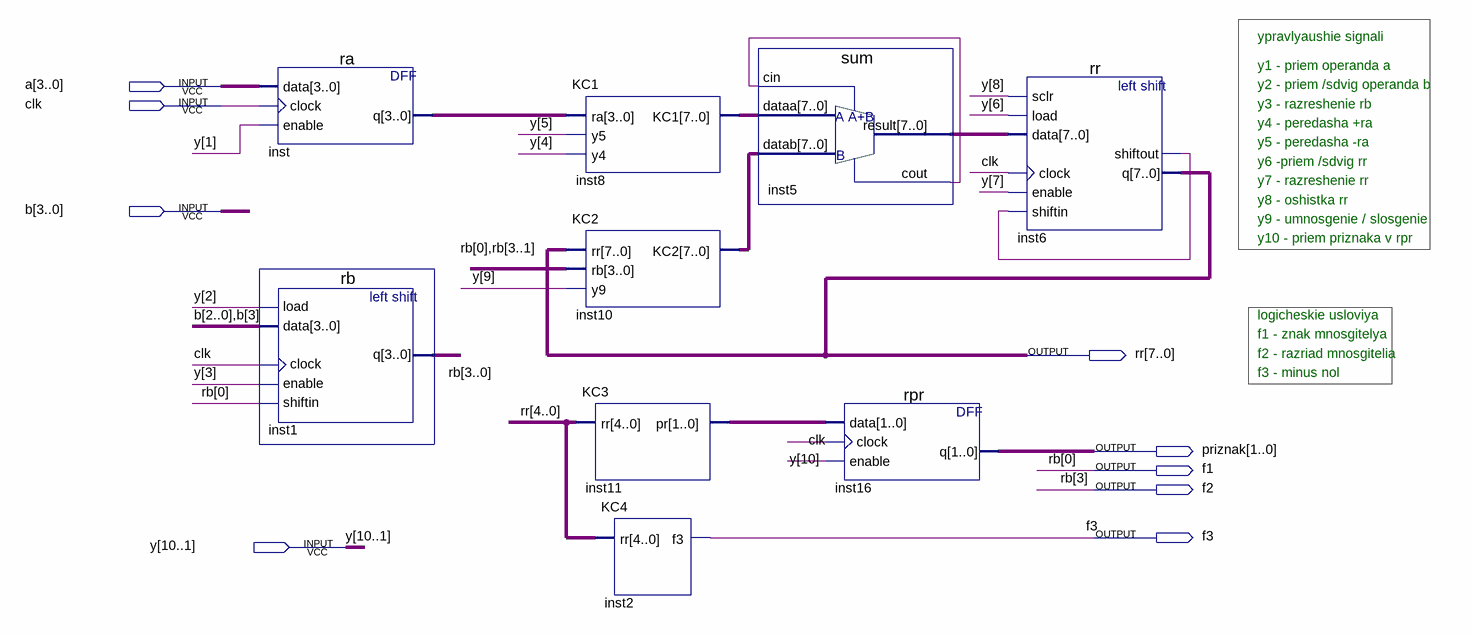
[diagram p0: schematic sheet]
// Quartus schematic blok_oper_sch.bdf as structural Verilog: 9 symbols, 9 pins
module blok_oper_sch (
  input  [3:0] a,
  input  clk,
  input  [3:0] b,
  input  [10:1] y,
  output [7:0] rr,
  output [1:0] priznak,
  output f1,
  output f2,
  output f3
);

  wire inst5_cout, inst6_shiftout;
  wire [1:0] inst11_pr;
  wire [2:1] rb;
  wire [3:0] inst_q;
  wire [7:0] inst5_result, inst8_kc1, inst10_kc2;

  ra inst (.data(a), .clock(clk), .enable(y[1]), .q(inst_q));
  rb inst1 (.load(y[2]), .data({b[2:0], b[3]}), .clock(clk), .enable(y[3]), .shiftin(f1), .q({f2, rb, f1}));
  KC1 inst8 (.ra(inst_q), .y5(y[5]), .y4(y[4]), .KC1(inst8_kc1));
  KC2 inst10 (.rr(rr), .rb({f1, f2, rb}), .y9(y[9]), .KC2(inst10_kc2));
  KC3 inst11 (.rr(rr[4:0]), .pr(inst11_pr));
  KC4 inst2 (.rr(rr[4:0]), .f3(f3));
  sum inst5 (.cin(inst5_cout), .dataa(inst8_kc1), .datab(inst10_kc2), .result(inst5_result), .cout(inst5_cout));
  rpr inst16 (.data(inst11_pr), .clock(clk), .enable(y[10]), .q(priznak));
  rr inst6 (
    .sclr(y[8]), .load(y[6]), .data(inst5_result), .clock(clk), .enable(y[7]), .shiftin(inst6_shiftout),
    .shiftout(inst6_shiftout), .q(rr));

  // Other names for the same wires on the sheet: rb (some bits) = {f2, f1}

  // Notes on the sheet:
  //   ypravlyaushie signali
  //   y1 - priem operanda a
  //   y2 - priem /sdvig operanda b
  //   y3 - razreshenie rb
  //   y4 - peredasha +ra
  //   y5 - peredasha -ra
  //   y6 -priem /sdvig rr
  //   y7 - razreshenie rr
  //   y8 - oshistka rr
  //   y9 - umnosgenie / slosgenie
  //   y10 - priem priznaka v rpr
  //   logicheskie usloviya
  //   f1 - znak mnosgitelya
  //   f2 - razriad mnosgitelia
  //   f3 - minus nol
endmodule
